# Altium schematic sheet Encoders.SchDoc
size OrCAD A
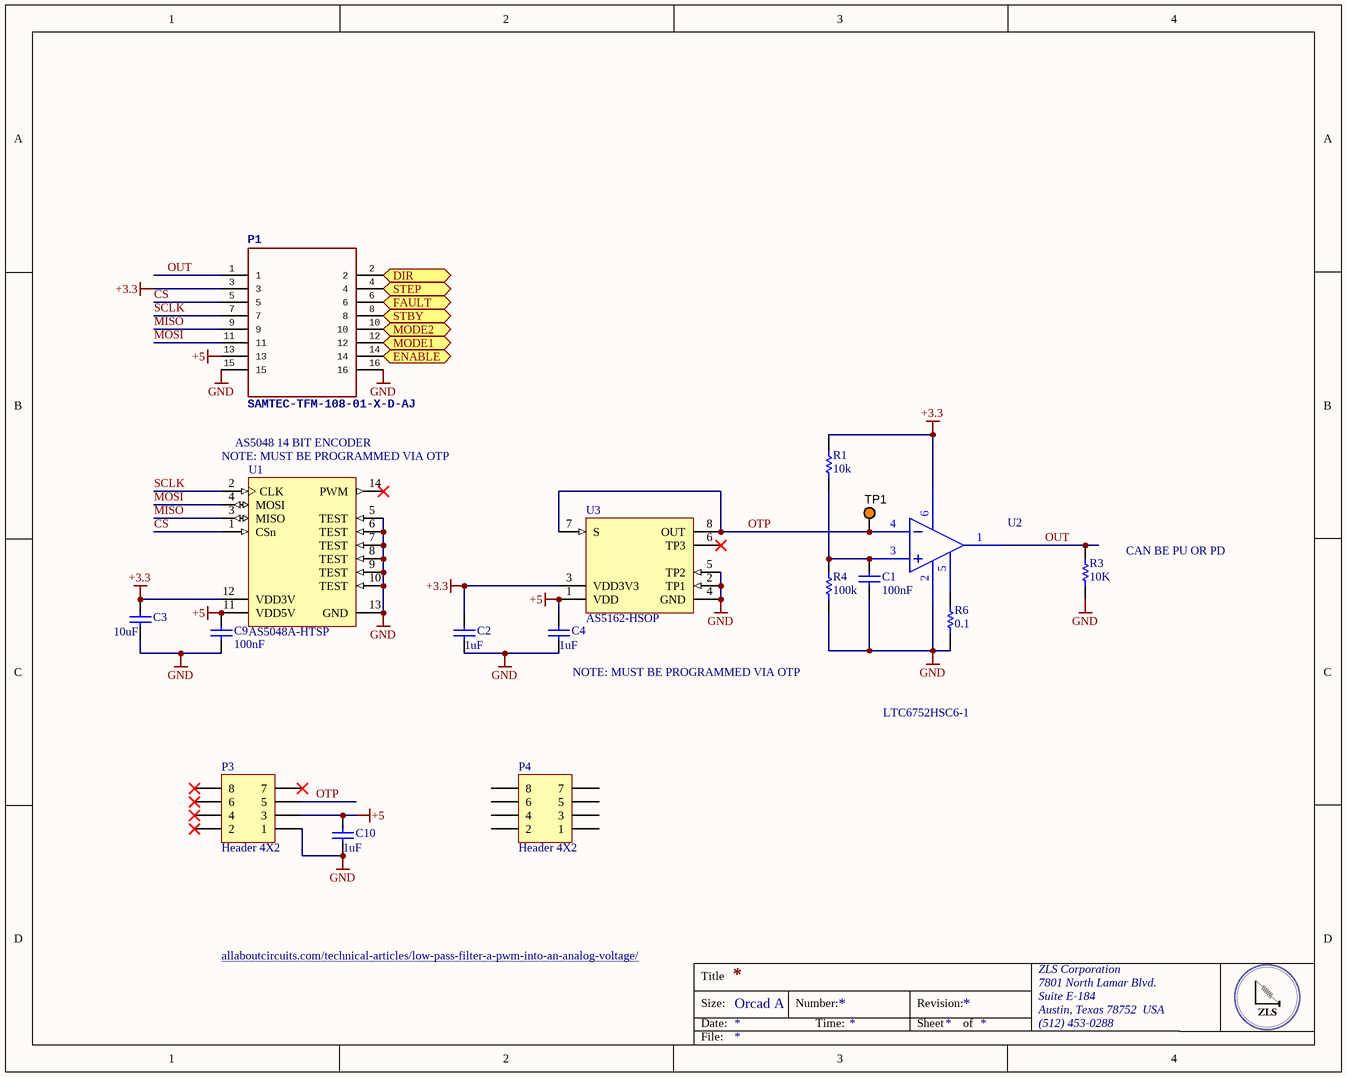
[diagram p0: Encoders.SchDoc]

## Parts
C1  Capacitance: 100nF  [CAPC2013X135X50ML15T20]  (hidden comment: VJ0805Y104KXXCW1BC)
C2  1uF  [CAPC2013X135X50ML15T20]
C3  10uF  [CAPC2013X135X50ML15T20]
C4  1uF  [CAPC2013X135X50ML15T20]
C9  Capacitance: 100nF  [CAPC2013X135X50ML15T20]  (hidden comment: VJ0805Y104KXXCW1BC)
C10  1uF  [CAPC2013X135X50ML15T20]
P1  SAMTEC-TFM-108-01-X-D-AJ  [SAMTEC-TFM-108-01-X-D-A]
P3  Header 4X2  [HDR2X4]
P4  Header 4X2  [HDR2X4]
R1  10k  [RESC0603(1608)_N]
R3  10K  [RESC0603(1608)_N]
R4  100k  [RESC0603(1608)_N]
R6  0.1  [RESC0603(1608)_N]
TP1  5003  [KSTN-5003]  (value not drawn)
U1  AS5048A-HTSP  [AMS-TSSOP-14-5000X4400DE_L]
U2  LTC6752HSC6-1TRMPBF  (value not drawn)
U3  AS5162-HSOP  [AMS-SOIC-8-4900X3900DE_M]

## Ports
DIR, ENABLE, FAULT, MODE1, MODE2, STBY, STEP

## Nets
+3.3: C2.2 C3.2 P1.3 R1.2 U1.12(VDD3V) U2.6(V+) U3.3(VDD3V3)
+5: C4.2 C9.2 C10.2 P1.13 P3.3 U1.11(VDD5V) U3.1(VDD)
GND: C1.1 C2.1 C3.1 C4.1 C9.1 C10.1 P1.15 P1.16 P3.1 R3.1 R4.1 R6.1 U1.5(TEST) U1.6(TEST) U1.7(TEST) U1.8(TEST) U1.9(TEST) U1.10(TEST) U1.13(GND) U2.2(V-) U3.2(TP1) U3.4(GND) U3.5(TP2)
CS: P1.5 U1.1(CSn)
DIR: P1.2 ; port DIR
ENABLE: P1.14 ; port ENABLE
FAULT: P1.6 ; port FAULT
MISO: P1.9 U1.3(MISO)
MODE1: P1.12 ; port MODE1
MODE2: P1.10 ; port MODE2
MOSI: P1.11 U1.4(MOSI)
OTP: P3.5 TP1.1 U2.4(-IN) U3.7(S) U3.8(OUT)
OUT: P1.1 R3.2 U2.1(OUT)
SCLK: P1.7 U1.2(CLK)
STBY: P1.8 ; port STBY
STEP: P1.4 ; port STEP
NetC1_2: C1.2 R1.1 R4.2 U2.3(+IN)
NetR6_2: R6.2 U2.5(HYS)

Not connected (* = marked no-connect by the designer): P3 2* 4* 6* 7* 8*; P4 1 2 3 4 5 6 7 8; U1 14(PWM)*; U3 6(TP3)*

## Notes on the sheet
- (near U1) NOTE: MUST BE PROGRAMMED VIA OTP
- (near U1) AS5048 14 BIT ENCODER
- (near R3) CAN BE PU OR PD
- (near C4) NOTE: MUST BE PROGRAMMED VIA OTP
- LTC6752HSC6-1
- allaboutcircuits.com/technical-articles/low-pass-filter-a-pwm-into-an-analog-voltage/
- Title
- Size:
- Date:
- Orcad A
- Number:
- Time:
- Revision:
- Sheet
- of
- ZLS Corporation
- 7801 North Lamar Blvd.
- Suite E-184
- Austin, Texas 78752  USA
- (512) 453-0288
- File:

## Library data of the parts
C1 C9 = CMP-2007-03442-1: 0.1µF ±10% 25V Ceramic Capacitor X7R 0805 (2012 Metric); Manufacturer: Vitramon; Dielectric Material: Tantalum; Part Number: VJ0805Y104KXXCW1BC; Supplier 1: Digi-Key; Supplier Part Number 1: 720-1537-1-ND; Manufacturer Part Number: VJ0805Y104KXXCW1BC; Stock 1: 72674; Pricing 1: 1=0.26000, 10=0.17900, 100=0.10120, 500=0.07142, 1000=0.06250 (USD); RoHS: Yes; Mount: Surface Mount; Case/Package: 0805; Number of Pins: 2; Weight: 0.000194oz; Case Code (Imperial): 0805; Case Code (Metric): 2012; Min Operating Temperature: -55°C; Max Operating Temperature: 125°C; Tolerance: 10%; Packaging: Tape and Reel; Voltage Rating: 25V; Dielectric: X7R; Package Quantity: 4000; Voltage Rating (DC): 25V; Termination: SMD/SMT; Length: 2mm; Height: 1.45mm; Width: 1.25mm; Thickness: 0.037inch; Depth: 1.25mm; Lead Free: Lead Free; ComponentLink1URL: https://datasheet.ciiva.com/11491/vjw1bcbascomseries-11491758.pdf?src-supplier=Avnet; ComponentLink1Description: https://datasheet.ciiva.com/11491/vjw1bcbascomseries-11491758.pdf?src-supplier=Avnet; ComponentLink2URL: https://datasheet.ciiva.com/176/vjw1bcbascomseries-176875.pdf?src-supplier=Digi-Key; ComponentLink2Description: https://datasheet.ciiva.com/176/vjw1bcbascomseries-176875.pdf?src-supplier=Digi-Key
C2-C4 C10 = CMP-2007-03442-1: 0.1µF ±10% 25V Ceramic Capacitor X7R 0805 (2012 Metric)
P3 P4 = Header 4X2: Header, 4-Pin, Dual row; LatestRevisionDate: 17-Jul-2002; LatestRevisionNote: Re-released for DXP Platform.; Publisher: Altium Limited
R1 R4 = CMP-1012-00511-1: 0R12 0.1W 1% 0603 (1608 Metric)  SMD
R3 R6 = CMP-1012-00511-1: 0R12 0.1W 1% 0603 (1608 Metric)  SMD; Manufacturer: Vishay; Manufacturer Part Number: CRCW060310K0FKEA; Value: 1020.00 Ohm; Case-EIA: 0603; Case-Metric: 1608; Resistance: 10kR; Power Rating: 100mW; Voltage Rating: 75V; Temperature Coefficient: 100ppm/°C; Technology: SMT; Power: 0.1 W; Tolerance: 1 %; Supplier 1: Digi-Key; Supplier Part Number 1: 311-0.0GRDKR-ND; Stock 1: 49641653; Pricing 1: 1=0.1, 10=0.021, 25=0.0152, 50=0.0114, 100=0.0084, 250=0.00644, 500=0.00514, 1000=0.00379 (USD); Case/Package: 0603; Number of Pins: 2; Weight: 7.1E-05oz; Case Code (Metric): 1608; Case Code (Imperial): 0603; Contact Plating: Lead,Tin; Min Operating Temperature: -55°C; Max Operating Temperature: 155°C; Packaging: Tape and Reel; Package Quantity: 10; Composition: Thick Film; Military Standard: Not; Termination: SMD/SMT; Voltage Rating (DC): 75V; Number of Terminations: 2; Max Power Dissipation: 100mW; Features: Automotive AEC-Q200; Length: 1.55mm; Height: 0.45mm; Width: 0.033inch; Depth: 0.85mm; Radiation Hardening: No; REACH SVHC: Unknown; Lead Free: Lead Free; ComponentLink1URL: http://www.vishay.com/docs/20008/dcrcw.pdf; ComponentLink1Description: http://www.vishay.com/docs/20008/dcrcw.pdf; ComponentLink2URL: https://www.verical.com/server-webapp/html/getDatasheet?partID=86831; ComponentLink2Description: https://www.verical.com/server-webapp/html/getDatasheet?partID=86831; ComponentLink3URL: http://www.farnell.com/datasheets/2310790.pdf; ComponentLink3Description: http://www.farnell.com/datasheets/2310790.pdf; ComponentLink4URL: http://www.vishay.com/docs/20035/dcrcwe3.pdf; ComponentLink4Description: http://www.vishay.com/docs/20035/dcrcwe3.pdf; ComponentLink5URL: http://www.farnell.com/datasheets/2111203.pdf; ComponentLink5Description: http://www.farnell.com/datasheets/2111203.pdf; ComponentLink6URL: http://uk.rs-online.com/webdocs/0d98/0900766b80d98afc.pdf; ComponentLink6Description: http://uk.rs-online.com/webdocs/0d98/0900766b80d98afc.pdf
TP1 = CMP-1672-00009-1: Test Point, Orange, 1-Pin THD, RoHS; Peak Reverse Current: 600 uA; Forward Current: 3 A; Max Surge Current: 80 A; Forward Voltage: 1.08 V; Max Operating Temperature: 150 degC; PackageReference: 5003; Pins: 2; ComponentLink2URL: http://keyelco.com/userAssets/file/M65p56.pdf; PackageDescription: 1-Pin Through Hole Device, Dia 2.54 mm; Weight: 0.01 lb; Diameter: 5.3 mm; Mount: Through Hole; Package Quantity: 500; Packaging: Bulk; Min Operating Temperature: -65 degC; ComponentLink1Description: Manufacturer URL; Height: 0.25 inch; ComponentLink1URL: http://www.keyelco.com/; ComponentLink2Description: Datasheet; Width: 0.25 inch; REACH SVHC: No SVHC; RoHSCompliant: true; Radiation Hardening: No; Length: 9.5 mm; DatasheetVersion: Jun-15
U1 = CMP-0555-00034-2: Magnetic Rotary Encoder 14-bit Angular Position Sensor, 3.3 or 5 V, TSSOP-14, Pb-Free, Reel; Manufacturer: AMS; Supply Voltage (V): 3.3 or 5.0; Output: SPI, PWM; ComponentLink2URL: http://www.ams.com/eng/content/download/438523/1341157/143015; Mounting Technology: Surface Mount; PackageDescription: 14-Pin Small Outline Package, 5 x 4.4 mm Body, 0.65 mm Pitch; Resolution: 14-bit; ComponentLink1URL: www.ams.com; DatasheetVersion: Rev. 1.3; Features: SPI, PWM, In System Programmable; PartNumber: AS5048A-HTSP; Code_JEDEC: MO-153; PackageReference: TSSOP-14; PackageVersion: Rev. 2.7, 10/2010; ComponentLink1Description: Manufacturer URL; ComponentLink2Description: Datasheet
U2 = LTC6752HSC6-1TRMPBF: IC COMP R-R CMOS 280MHZ SC70-6
U3 = CMP-0555-00008-2: 12-Bit Magnetic Angle Position Sensor, 4.5 to 5.5 V, SOIC-8, Pb-Free, Reel; Manufacturer: AMS; ComponentLink1URL: www.ams.com; Code_JEDEC: MS-012; ComponentLink1Description: Manufacturer URL; DatasheetVersion: Rev. 1.3; ComponentLink2Description: Datasheet; PackageReference: SOIC-8; PackageVersion: N/C, 09/2010; ComponentLink2URL: http://www.ams.com/eng/content/download/326803/1143657/185575; Mounting Technology: Surface Mount; Packing: Reel; PartNumber: AS5162-HSOP; PackageDescription: 8-Pin Small Outline Integrated Circuit, 4.9 x 3.9 mm Body, 1.27 mm Pitch